# EAGLE design Accelerometer Schematic Rev1 (EAGLE 9.6.2)
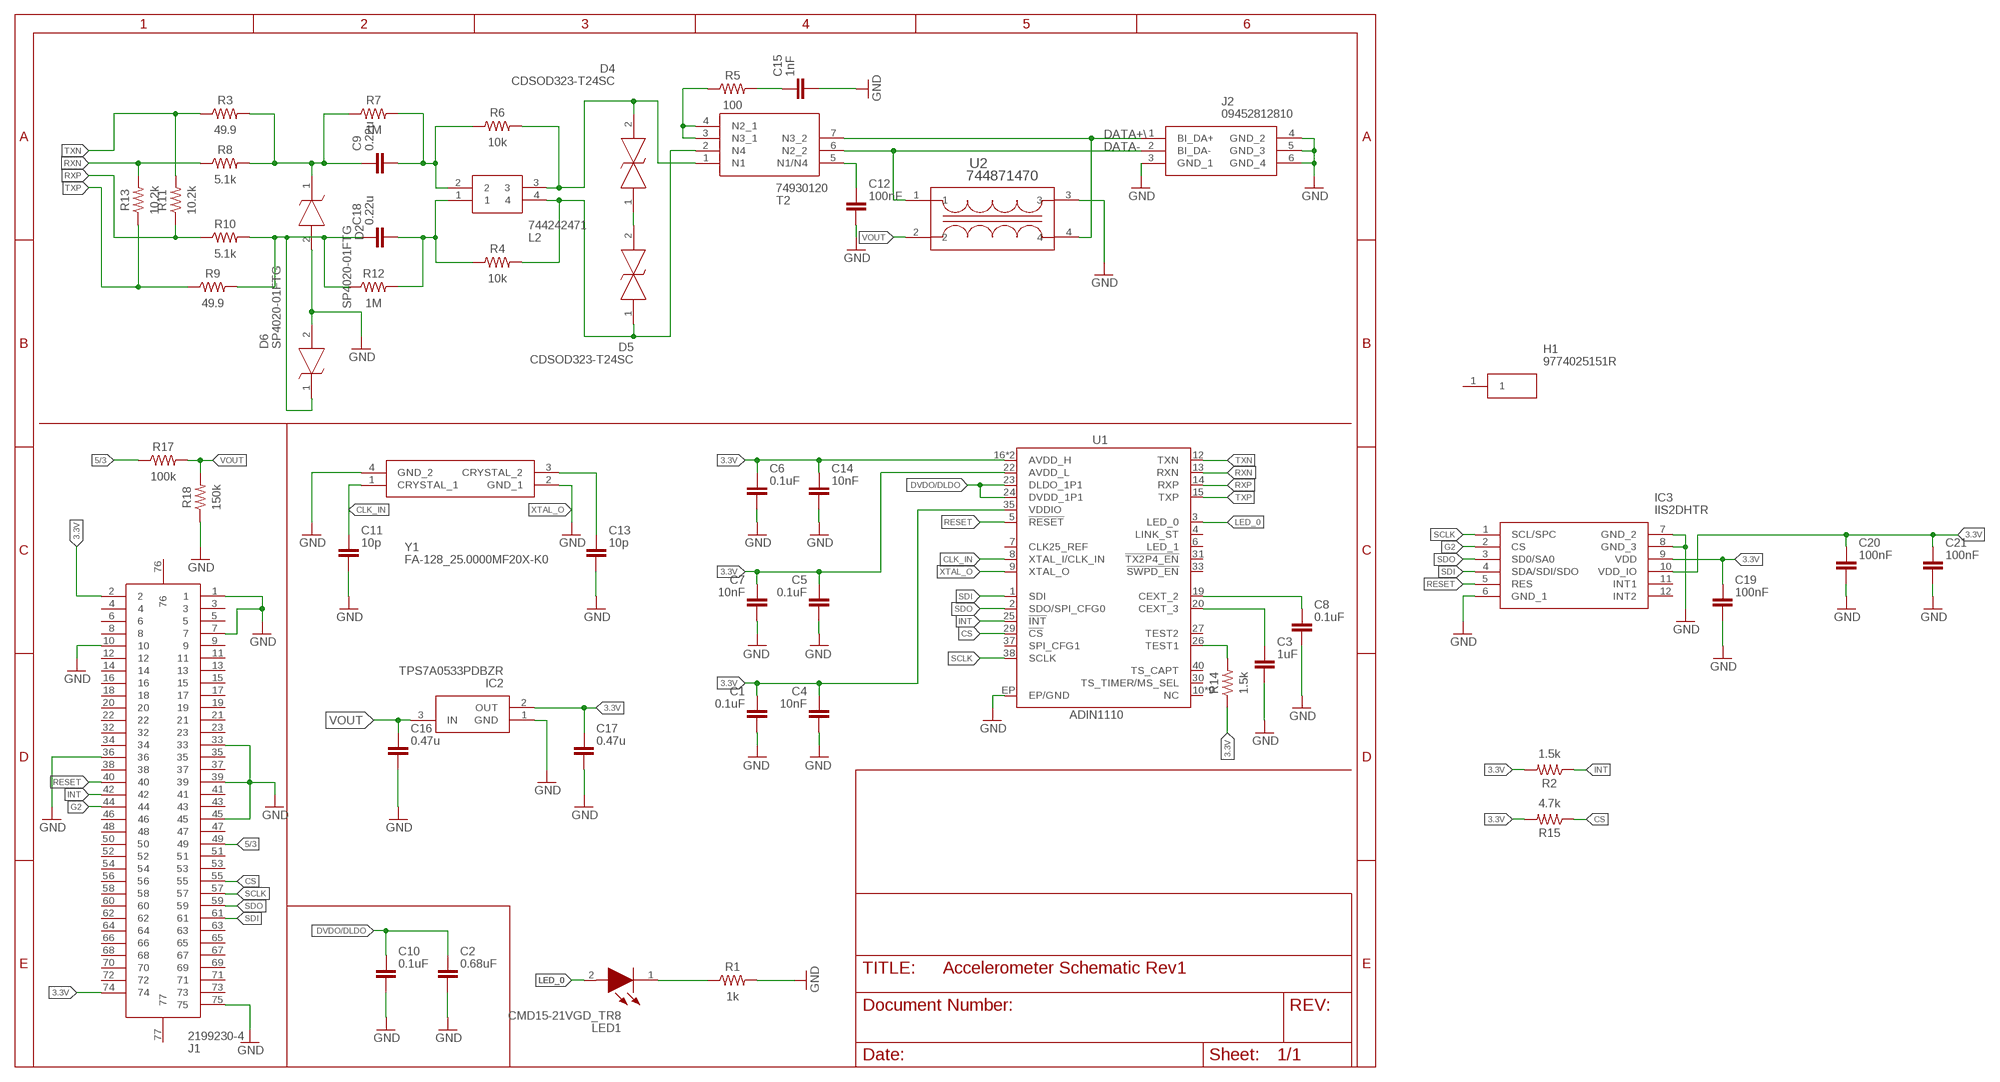
[diagram p0: schematic, sheet 1]

## Parts
C1  0.1uF  C_CHIP-0402(1005-METRIC)  [CAPC1005X60]
C2  0.68uF  C_CHIP-0402(1005-METRIC)  [CAPC1005X60]
C3  1uF  C_CHIP-0402(1005-METRIC)  [CAPC1005X60]
C4  10nF  C_CHIP-0402(1005-METRIC)  [CAPC1005X60]
C5  0.1uF  C_CHIP-0402(1005-METRIC)  [CAPC1005X60]
C6  0.1uF  C_CHIP-0402(1005-METRIC)  [CAPC1005X60]
C7  10nF  C_CHIP-0402(1005-METRIC)  [CAPC1005X60]
C8  0.1uF  C_CHIP-0402(1005-METRIC)  [CAPC1005X60]
C9  0.22u  C_CHIP-0402(1005-METRIC)  [CAPC1005X60]
C10  0.1uF  C_CHIP-0402(1005-METRIC)  [CAPC1005X60]
C11  10p  C_CHIP-0402(1005-METRIC)  [CAPC1005X60]
C12  100nF  C_CHIP-0402(1005-METRIC)  [CAPC1005X60]
C13  10p  C_CHIP-0402(1005-METRIC)  [CAPC1005X60]
C14  10nF  C_CHIP-0402(1005-METRIC)  [CAPC1005X60]
C15  1nF  C_CHIP-0402(1005-METRIC)  [CAPC1005X60]
C16  0.47u  C_CHIP-0402(1005-METRIC)  [CAPC1005X60]
C17  0.47u  C_CHIP-0402(1005-METRIC)  [CAPC1005X60]
C18  0.22u  C_CHIP-0402(1005-METRIC)  [CAPC1005X60]
C19  100nF  C_CHIP-0402(1005-METRIC)  [CAPC1005X60]
C20  100nF  C_CHIP-0402(1005-METRIC)  [CAPC1005X60]
C21  100nF  C_CHIP-0402(1005-METRIC)  [CAPC1005X60]
D2  SP4020-01FTG  [SOD2613X114N]
D4  CDSOD323-T24SC  [SOD2513X114N]
D5  CDSOD323-T24SC  [SOD2513X114N]
D6  SP4020-01FTG  [SOD2613X114N]
H1  9774025151R  [9774025151R]
IC2  TPS7A0533PDBZR  [SOT95P237X112-3N]
IC3  IIS2DHTR  [LGA-12]
J1  2199230-4  [21992304]
J2  09452812810  [09452812810]
L2  744242471  [744242471]
LED1  CMD15-21VGD_TR8  [LEDC3215X130N]
R1  1k  R-US_CHIP-0402(1005-METRIC)  [RESC1005X40]
R2  1.5k  R-US_CHIP-0402(1005-METRIC)  [RESC1005X40]
R3  49.9  R-US_CHIP-0402(1005-METRIC)  [RESC1005X40]
R4  10k  R-US_CHIP-0402(1005-METRIC)  [RESC1005X40]
R5  100  R-US_CHIP-0402(1005-METRIC)  [RESC1005X40]
R6  10k  R-US_CHIP-0402(1005-METRIC)  [RESC1005X40]
R7  1M  R-US_CHIP-0402(1005-METRIC)  [RESC1005X40]
R8  5.1k  R-US_CHIP-0402(1005-METRIC)  [RESC1005X40]
R9  49.9  R-US_CHIP-0402(1005-METRIC)  [RESC1005X40]
R10  5.1k  R-US_CHIP-0402(1005-METRIC)  [RESC1005X40]
R11  10.2k  R-US_CHIP-0402(1005-METRIC)  [RESC1005X40]
R12  1M  R-US_CHIP-0402(1005-METRIC)  [RESC1005X40]
R13  10.2k  R-US_CHIP-0402(1005-METRIC)  [RESC1005X40]
R14  1.5k  R-US_CHIP-0402(1005-METRIC)  [RESC1005X40]
R15  4.7k  R-US_CHIP-0402(1005-METRIC)  [RESC1005X40]
R17  100k  R-US_CHIP-0402(1005-METRIC)  [RESC1005X40]
R18  150k  R-US_CHIP-0402(1005-METRIC)  [RESC1005X40]
T2  74930120  [74930120]
U1  ADIN1110  [LFCSP-40]
U2  744871470  [SMT_871470_WRE]
Y1  FA-128_25.0000MF20X-K0  [FA128250000MF20XK0]

## Nets
3.3V: C1.1 C4.1 C5.1 C6.1 C7.1 C14.1 C17.1 C19.1 C20.1 C21.1 IC2.2(OUT) IC3.9(VDD) IC3.10(VDD_IO) J1.2 J1.74 R2.2 R14.1 R15.2 U1.16(AVDD_H) U1.17(AVDD_H) U1.22(AVDD_L) U1.35(VDDIO)
5/3: J1.49 R17.1
CLK_IN: C11.1 U1.8(XTAL_I/CLK_IN) Y1.1(CRYSTAL_1)
CS: J1.55 R15.1 U1.29(!CS!)
DATA+\: J2.1(BI_DA+) T2.7(N3_2) U2.4
DATA-: J2.2(BI_DA-) T2.6(N2_2) U2.1
DVDO/DLDO: C2.1 C10.1 U1.23(DLDO_1P1) U1.24(DVDD_1P1)
G2: IC3.2(CS) J1.44
GND: C1.2 C2.2 C3.2 C4.2 C5.2 C6.2 C7.2 C8.2 C10.2 C11.2 C12.2 C13.2 C14.2 C15.2 C16.2 C17.2 C19.2 C20.2 C21.2 D2.2(A) D6.2(A) IC2.1(GND) IC3.6(GND_1) IC3.7(GND_2) IC3.8(GND_3) J1.1 J1.7 J1.10 J1.33 J1.36 J1.39 J1.45 J1.75 J2.3(GND_1) J2.4(GND_2) J2.5(GND_3) J2.6(GND_4) R1.2 R18.1 U1.EP(EP/GND) U2.3 Y1.2(GND_1) Y1.4(GND_2)
INT: J1.42 R2.1 U1.25(!INT!)
LED_0: LED1.2(A) U1.3(LED_0)
N$1: C15.1 R5.2
N$2: LED1.1(K) R1.1
N$16: C18.2 L2.1 R4.1 R12.2
N$18: R14.2 U1.26(TEST1)
N$19: C9.2 L2.2 R6.1 R7.2
N$20: D5.1 L2.4 R4.2 T2.2(N4)
N$21: C8.1 U1.19(CEXT_2)
N$22: C3.1 U1.20(CEXT_3)
N$24: C9.1 D2.1(K) R3.2 R7.1 R8.2
N$28: C12.1 T2.5(N1/N4)
N$30: R5.1 T2.3(N3_1) T2.4(N2_1)
N$31: C18.1 D6.1(K) R9.2 R10.2 R12.1
N$42: D4.2 L2.3 R6.2 T2.1(N1)
N$43: D4.1 D5.2
RESET: IC3.5(RES) J1.40 U1.5(!RESET!)
RXN: R8.1 R13.2 U1.13(RXN)
RXP: R10.1 R11.1 U1.14(RXP)
SCLK: IC3.1(SCL/SPC) J1.57 U1.38(SCLK)
SDI: IC3.4(SDA/SDI/SDO) J1.61 U1.1(SDI)
SDO: IC3.3(SD0/SA0) J1.59 U1.2(SDO/SPI_CFG0)
TXN: R3.1 R11.2 U1.12(TXN)
TXP: R9.1 R13.1 U1.15(TXP)
VOUT: C16.1 IC2.3(IN) R17.2 R18.2 U2.2
XTAL_O: C13.1 U1.9(XTAL_O) Y1.3(CRYSTAL_2)
Unconnected: H1.1 IC3.11(INT1) IC3.12(INT2) J1.3 J1.4 J1.5 J1.6 J1.8 J1.9 J1.11 J1.12 J1.13 J1.14 J1.15 J1.16 J1.17 J1.18 J1.19 J1.20 J1.21 J1.22 J1.23 J1.32 J1.34 J1.35 J1.37 J1.38 J1.41 J1.43 J1.46 J1.47 J1.48 J1.50 J1.51 J1.52 J1.53 J1.54 J1.56 J1.58 J1.60 J1.62 J1.63 J1.64 J1.65 J1.66 J1.67 J1.68 J1.69 J1.70 J1.71 J1.72 J1.73 J1.76 J1.77 U1.4(LINK_ST) U1.6(LED_1) U1.7(CLK25_REF) U1.10(NC) U1.11(NC) U1.18(NC) U1.21(NC) U1.27(TEST2) U1.28(NC) U1.30(TS_TIMER/MS_SEL) U1.31(!TX2P4_EN!) U1.32(NC) U1.33(!SWPD_EN!) U1.34(NC) U1.36(NC) U1.37(SPI_CFG1) U1.39(NC) U1.40(TS_CAPT)

## Library data of the parts
C1-C21 = Capacitor:C: Capacitor - Generic; CATEGORY: Capacitor
D2 D6 = SamacSys_Parts:SP4020-01FTG: Littelfuse TVS Diode Array Uni-Directional, 750W Triple, 2-Pin SOD-323 SP4020-01FTG, Source: Datasheet <https://www.littelfuse.com/~/media/electronics/datasheets/tvs_diode_arrays/littelfuse_tvs_diode_array_sp4020_datasheet.pdf.pdf>; DESCRIPTION: Littelfuse TVS Diode Array Uni-Directional, 750W Triple, 2-Pin SOD-323 SP4020-01FTG,; HEIGHT: 1.14mm; MANUFACTURER_NAME: LITTELFUSE; MANUFACTURER_PART_NUMBER: SP4020-01FTG; MOUSER_PART_NUMBER: 576-SP4020-01FTG; MOUSER_PRICE-STOCK: https://www.mouser.co.uk/ProductDetail/Littelfuse/SP4020-01FTG?qs=eIdvKxokjW4Yi6Ov7kZjPg%3D%3D
D4 D5 = SamacSys_Parts:CDSOD323-T24SC: ESD Suppressors / TVS Diodes Bidirectional Std Cap Source: Datasheet <https://www.bourns.com/docs/Product-Datasheets/CDSOD323-TxxLC.pdf>; ARROW_PART_NUMBER: CDSOD323-T24SC; ARROW_PRICE-STOCK: https://www.arrow.com/en/products/cdsod323-t24sc/bourns?region=nac; DESCRIPTION: ESD Suppressors / TVS Diodes Bidirectional Std Cap; HEIGHT: 1.14mm; MANUFACTURER_NAME: Bourns; MANUFACTURER_PART_NUMBER: CDSOD323-T24SC; MOUSER_PART_NUMBER: 652-CDSOD323-T24SC; MOUSER_PRICE-STOCK: https://www.mouser.co.uk/ProductDetail/Bourns/CDSOD323-T24SC?qs=6S5Watp5UnLXKCNVDRqkmw%3D%3D
H1 = 9774025151R:9774025151R: 9774025151R, 2.5mm High Steel Round Spacer With 5.1mm Diameter and 3.5mm Bore Diameter for M2.5 Screw Source: Datasheet <https://componentsearchengine.com/Datasheets/2/9774025151R.pdf>; DESCRIPTION: 9774025151R, 2.5mm High Steel Round Spacer With 5.1mm Diameter and 3.5mm Bore Diameter for M2.5 Screw; HEIGHT: 3.9mm; MANUFACTURER_NAME: Wurth Elektronik; MANUFACTURER_PART_NUMBER: 9774025151R; MOUSER_PART_NUMBER: 710-9774025151R; MOUSER_PRICE-STOCK: https://www.mouser.co.uk/ProductDetail/Wurth-Elektronik/9774025151R?qs=KRpiEsko4Hn1l7MecUfDpA%3D%3D
IC2 = SamacSys_Parts:TPS7A0533PDBZR: 1-A, ultra-low-IQ, 200-mA low-dropout (LDO) regulator in a small-sized package Source: Datasheet <https://www.ti.com/lit/gpn/TPS7A05>; DESCRIPTION: 1-A, ultra-low-IQ, 200-mA low-dropout (LDO) regulator in a small-sized package; HEIGHT: 1.12mm; MANUFACTURER_NAME: Texas Instruments; MANUFACTURER_PART_NUMBER: TPS7A0533PDBZR; MOUSER_PART_NUMBER: 595-TPS7A0533PDBZR; MOUSER_PRICE-STOCK: https://www.mouser.co.uk/ProductDetail/Texas-Instruments/TPS7A0533PDBZR?qs=XeJtXLiO41SvDtfTV1kb9A%3D%3D
IC3 = SamacSys_Parts:IIS2DHTR: STMicroelectronics IIS2DHTR 3-Axis Accelerometer Ic, 1.71 3.6 V 12-Pin LGA Source: Datasheet <http://www.st.com/content/ccc/resource/technical/document/datasheet/group1/35/6d/04/26/27/5c/4d/7c/DM00171283/files/DM00171283.pdf/jcr:content/translations/en.DM00171283.pdf>; ARROW_PART_NUMBER: IIS2DHTR; ARROW_PRICE-STOCK: https://www.arrow.com/en/products/iis2dhtr/stmicroelectronics; DESCRIPTION: STMicroelectronics IIS2DHTR 3-Axis Accelerometer Ic, 1.71 3.6 V 12-Pin LGA; HEIGHT: mm; MANUFACTURER_NAME: STMicroelectronics; MANUFACTURER_PART_NUMBER: IIS2DHTR; MOUSER_PART_NUMBER: 511-IIS2DHTR; MOUSER_PRICE-STOCK: https://www.mouser.co.uk/ProductDetail/STMicroelectronics/IIS2DHTR?qs=v3MacVxtdDJnR1enHkQ8Pw%3D%3D
J1 = SamacSys_Parts:2199230-4: AMP - TE CONNECTIVITY - 2199230-4 - CONNECTOR, CARD EDGE, RCPT, 67POS, 2ROW Source: Datasheet <https://www.te.com/commerce/DocumentDelivery/DDEController?Action=srchrtrv&DocNm=2199230&DocType=Customer Drawing&DocLang=English&DocFormat=pdf&PartCntxt=2199230-4>; DESCRIPTION: AMP - TE CONNECTIVITY - 2199230-4 - CONNECTOR, CARD EDGE, RCPT, 67POS, 2ROW; HEIGHT: mm; MANUFACTURER_NAME: TE Connectivity; MANUFACTURER_PART_NUMBER: 2199230-4; MOUSER_PART_NUMBER: 571-2199230-4; MOUSER_PRICE-STOCK: https://www.mouser.co.uk/ProductDetail/TE-Connectivity/2199230-4?qs=EQCnRgr4b6HnhitEoflgGQ%3D%3D
J2 = SamacSys_Parts:09452812810: T1 Industrial Jack Connectors, PCB connector, Angled, THR connection, Rated current: 4 A, Contacts: 2, + shielding Source: Datasheet <https://b2b.harting.com/files/download/PRD/PDF_TS/09452812810_100689697DRW003M.pdf?siteName=Ebusiness Site&autoLogoutEnabled=false&autoLogoutTime=0&contextURL=https://b2b.harting.com/ebusiness/en&maintenanceAnnouncement={ }&showPrivacyEmailA>; DESCRIPTION: T1 Industrial Jack Connectors, PCB connector, Angled, THR connection, Rated current: 4 A, Contacts: 2, + shielding; HEIGHT: 6.1mm; MANUFACTURER_NAME: HARTING; MANUFACTURER_PART_NUMBER: 09452812810; MOUSER_PART_NUMBER: 617-09452812810; MOUSER_PRICE-STOCK: https://www.mouser.co.uk/ProductDetail/HARTING/09452812810?qs=IPgv5n7u5QYWjjwXDCl9%252Bw%3D%3D
L2 = SamacSys_Parts:744242471: WE-SLM SMD Common Mode Choke 470uH 400mA Source: Datasheet <http://katalog.we-online.com/pbs/datasheet/744242471.pdf>; DESCRIPTION: WE-SLM SMD Common Mode Choke 470uH 400mA; HEIGHT: 3mm; MANUFACTURER_NAME: Wurth Elektronik; MANUFACTURER_PART_NUMBER: 744242471; MOUSER_PART_NUMBER: 710-744242471; MOUSER_PRICE-STOCK: https://www.mouser.co.uk/ProductDetail/Wurth-Elektronik/744242471?qs=PGXP4M47uW7UIiGXUC0ZiA%3D%3D
LED1 = SamacSys_Parts:CMD15-21VGD_TR8: VCC CMD15-21VGD/TR8, CMD15-21 Series Clear LED, 570 nm,, Rectangle Lens Source: Datasheet <https://componentsearchengine.com/Datasheets/2/CMD15-21VGD_TR8.pdf>; ARROW_PART_NUMBER: CMD15-21VGD/TR8; ARROW_PRICE-STOCK: https://www.arrow.com/en/products/cmd15-21vgdtr8/visual-communications; DESCRIPTION: VCC CMD15-21VGD/TR8, CMD15-21 Series Clear LED, 570 nm,, Rectangle Lens; HEIGHT: 1.3mm; MANUFACTURER_NAME: Visual Communications Company; MANUFACTURER_PART_NUMBER: CMD15-21VGD/TR8; MOUSER_PART_NUMBER: 606-CMD15-21VGD/TR8; MOUSER_PRICE-STOCK: https://www.mouser.co.uk/ProductDetail/VCC/CMD15-21VGD-TR8?qs=rmKzSijf6EYPDoIZjcp6ew%3D%3D
R1-R15 R17 R18 = Resistor:R-US: Resistor Fixed - ANSI; CATEGORY: Resistor; SUB-CATEGORY: Fixed
T2 = SamacSys_Parts:74930120: WURTH ELEKTRONIK - 74930120 - Transformer, Ethernet, 1P, 10/100/1000/10G Base-T, PoE+, 1:1, Surface Mount Source: Datasheet <https://www.we-online.com/catalog/datasheet/74930120.pdf>; DESCRIPTION: WURTH ELEKTRONIK - 74930120 - Transformer, Ethernet, 1P, 10/100/1000/10G Base-T, PoE+, 1:1, Surface Mount; HEIGHT: 2.9mm; MANUFACTURER_NAME: Wurth Elektronik; MANUFACTURER_PART_NUMBER: 74930120; MOUSER_PART_NUMBER: 710-74930120; MOUSER_PRICE-STOCK: https://www.mouser.co.uk/ProductDetail/Wurth-Elektronik/74930120?qs=zW32dvEIR3sEJWqR2tCkqQ%3D%3D
U1 = ADIN1110:ADIN1110: The ADIN1110 is an ultra low power, single port, 10BASE-T1L transceiver design for industrial Ethernet applications and is compliant with the IEEE® 802.3cg-2019™ Ethernet standard for long reach, 10 Mbps single pair Ethernet (SPE).; PROD_ID: IC-16335
U2 = 744871470:744871470; COPYRIGHT: Copyright (C) 2023 Ultra Librarian. All rights reserved.; MANUFACTURER_PART_NUMBER: 744871470; MFR_NAME: Wurth Electronics
Y1 = SamacSys_Parts:FA-128_25.0000MF20X-K0: Crystals 25MHz 10PPM -40C +85C 10pF Source: Datasheet <https://support.epson.biz/td/api/doc_check.php?dl=brief_FA-128&lang=en>; DESCRIPTION: Crystals 25MHz 10PPM -40C +85C 10pF; HEIGHT: 0.5mm; MANUFACTURER_NAME: Epson Timing; MANUFACTURER_PART_NUMBER: FA-128 25.0000MF20X-K0; MOUSER_PART_NUMBER: 732-FA-12825F20X-K0; MOUSER_PRICE-STOCK: https://www.mouser.co.uk/ProductDetail/Epson-Timing/FA-128-250000MF20X-K0?qs=csoGsJbXmtBBrE23v3bRHg%3D%3D

## Board
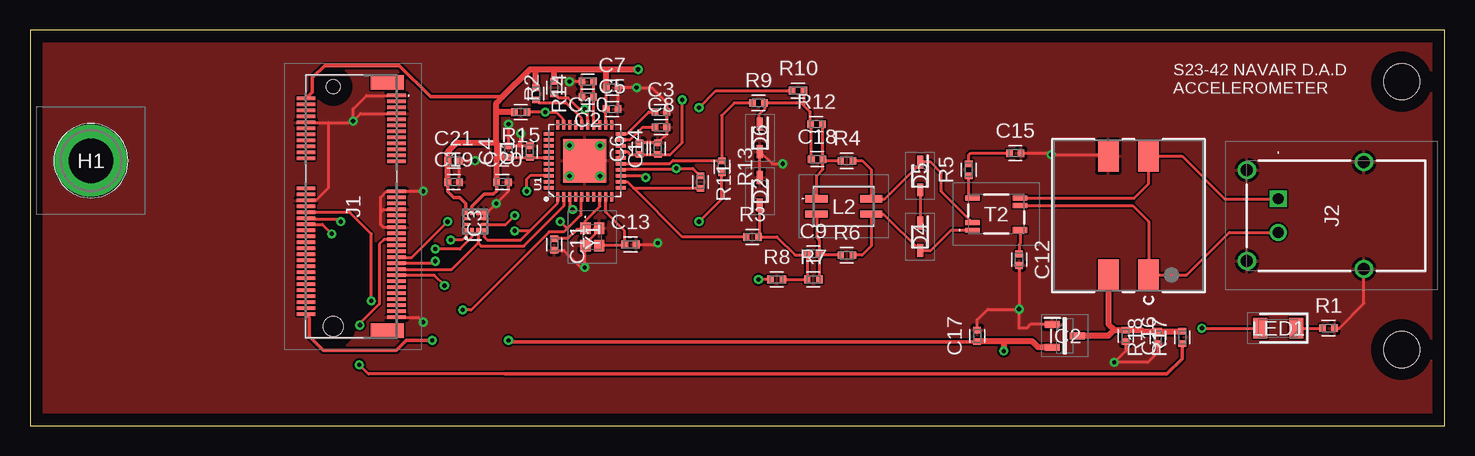
[diagram p1: board, top side]
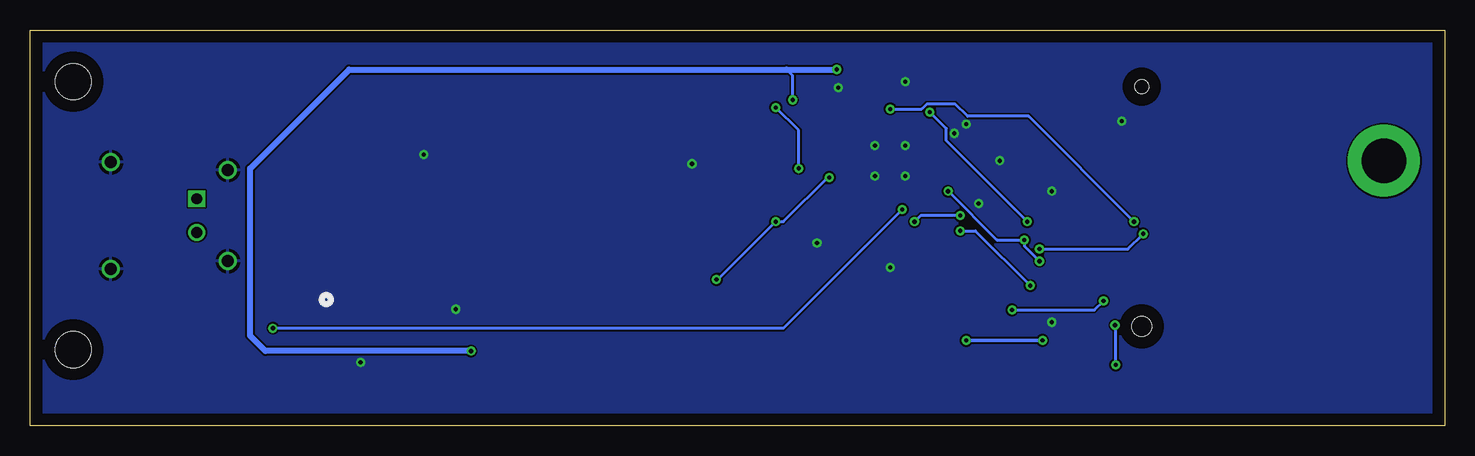
[diagram p2: board, bottom side, seen from below]

Size 117.91 x 33.01 mm. Coordinates in mm from the lower left corner, seen from the top.
Outline: 0,0 117.91,0 117.91,33.01 0,33.01 0,0
Copper layers (1*16): Top 0.035mm / dielectric 1.5mm / Bottom 0.035mm
Design rules "default": minimum track width 6mil, minimum drill 0.35mm, track to track 6mil, track to pad 6mil, pad to pad 6mil, via to via 6mil, smd to smd 6mil, copper to edge 40mil, drill to drill 6mil, minimum pad ring 10mil, minimum via ring 8mil, stop-mask expansion 4mil, vias tented up to drill 0mil, thermal gap 10mil
Holes 3 mm at 114.3,28.7 114.3,6.35

### Footprints (pad centres in the part's own frame; a part is rotated, then mirrored left to right if it is on the bottom)
CAPC1005X60 = smd 0.56 x 0.629: 1 -0.485,0; 2 0.485,0
SOD2613X114N = smd 1.075 x 0.5: 1 -1.15,0; 2 1.15,0
SOD2513X114N = smd 1.075 x 0.5: 1 -1.15,0; 2 1.15,0
9774025151R = drill 3.7 pad 6: 1 0,0
SOT95P237X112-3N = smd 1.25 x 0.6: 1 -1.05,0.95; 2 -1.05,-0.95; 3 1.05,0
LGA-12 = smd 0.508 x 0.254: 1 -0.8,0.75; 2 -0.8,0.25; 3 -0.8,-0.25; 4 -0.8,-0.75; 7 0.8,-0.75; 8 0.8,-0.25; 9 0.8,0.25; 10 0.8,0.75 | smd 0.254 x 0.508: 5 -0.25,-0.75; 6 0.25,-0.75; 11 0.25,0.75; 12 -0.25,0.75
21992304 = smd 0.3 x 1.55: 1 -9.25,3.625; 2 -9,-3.925; 3 -8.75,3.625; 4 -8.5,-3.925; 5 -8.25,3.625; 6 -8,-3.925; 7 -7.75,3.625; 8 -7.5,-3.925; 9 -7.25,3.625; 10 -7,-3.925; 11 -6.75,3.625; 12 -6.5,-3.925; 13 -6.25,3.625; 14 -6,-3.925; 15 -5.75,3.625; 16 -5.5,-3.925; 17 -5.25,3.625; 18 -5,-3.925; 19 -4.75,3.625; 20 -4.5,-3.925; 21 -4.25,3.625; 22 -4,-3.925; 23 -3.75,3.625; 32 -1.5,-3.925; 33 -1.25,3.625; 34 -1,-3.925; 35 -0.75,3.625; 36 -0.5,-3.925; 37 -0.25,3.625; 38 0,-3.925; 39 0.25,3.625; 40 0.5,-3.925; 41 0.75,3.625; 42 1,-3.925; 43 1.25,3.625; 44 1.5,-3.925; 45 1.75,3.625; 46 2,-3.925; 47 2.25,3.625; 48 2.5,-3.925; 49 2.75,3.625; 50 3,-3.925; 51 3.25,3.625; 52 3.5,-3.925; 53 3.75,3.625; 54 4,-3.925; 55 4.25,3.625; 56 4.5,-3.925; 57 4.75,3.625; 58 5,-3.925; 59 5.25,3.625; 60 5.5,-3.925; 61 5.75,3.625; 62 6,-3.925; 63 6.25,3.625; 64 6.5,-3.925; 65 6.75,3.625; 66 7,-3.925; 67 7.25,3.625; 68 7.5,-3.925; 69 7.75,3.625; 70 8,-3.925; 71 8.25,3.625; 72 8.5,-3.925; 73 8.75,3.625; 74 9,-3.925; 75 9.25,3.625 | smd 1.2 x 2.75: 76 -10.35,2.85; 77 10.35,2.85 | hole 1.15: -10,-1.65 | hole 1.65: 10,-1.65
09452812810 = drill 0.9 pad 1.4 square: 1 0,0 | drill 0.9 pad 1.4: 2 -2.8,0 | drill 1 pad 1.5: 3 -5.2,2.6; 4 2.4,2.6; 5 -5.85,-7.15; 6 3.05,-7.15
744242471 = smd 1.85 x 0.6: 1 -2.275,0.635; 2 -2.275,-0.635; 3 2.275,-0.635; 4 2.275,0.635
LEDC3215X130N = smd 1.15 x 1.7: 1 -1.5,0; 2 1.5,0
RESC1005X40 = smd 0.535 x 0.644: 1 -0.507,0; 2 0.507,0
74930120 = smd 1.2 x 0.41: 1 -1.99,-1.35; 2 -1.99,-0.7; 6 1.99,0.7; 7 1.99,1.35 | smd 0.6 x 0.41: 3 -2.29,1.35; 4 -1.69,1.35 | smd 1.2 x 0.5: 5 1.99,-1.35
LFCSP-40 = smd 0.8 x 0.285: 1 -3,2.25; 2 -3,1.75; 3 -3,1.25; 4 -3,0.75; 5 -3,0.25; 6 -3,-0.25; 7 -3,-0.75; 8 -3,-1.25; 9 -3,-1.75; 10 -3,-2.25; 21 3,-2.25; 22 3,-1.75; 23 3,-1.25; 24 3,-0.75; 25 3,-0.25; 26 3,0.25; 27 3,0.75; 28 3,1.25; 29 3,1.75; 30 3,2.25 | smd 0.285 x 0.8: 11 -2.25,-3; 12 -1.75,-3; 13 -1.25,-3; 14 -0.75,-3; 15 -0.25,-3; 16 0.25,-3; 17 0.75,-3; 18 1.25,-3; 19 1.75,-3; 20 2.25,-3; 31 2.25,3; 32 1.75,3; 33 1.25,3; 34 0.75,3; 35 0.25,3; 36 -0.25,3; 37 -0.75,3; 38 -1.25,3; 39 -1.75,3; 40 -2.25,3 | smd 3.6 x 3.6: EP 0,0
SMT_871470_WRE = smd 2.591 x 1.702: 1 0,0; 2 0,3.35; 3 9.9,3.35; 4 9.9,0
FA128250000MF20XK0 = smd 0.95 x 0.85: 1 -0.725,-0.575; 2 0.725,-0.575; 3 0.725,0.575; 4 -0.725,0.575

### Placement (x,y rotation side)
C1  41.66,22.86 90 top
C2  46.48,27.43 180 top
C3  52.58,26.16 0 top
C4  39.88,22.86 90 top
C5  48.51,26.42 0 top
C6  50.8,23.11 90 top
C7  48.51,28.19 0 top
C8  52.58,24.89 0 top
C9  65.28,14.35 0 top
C10  46.48,28.7 180 top
C11  43.69,15.11 270 top
C12  82.42,13.84 270 top
C13  50.04,15.11 0 top
C14  52.32,23.11 90 top
C15  82.11,22.73 0 top
C16  91.31,7.49 270 top
C17  78.93,7.49 90 top
C18  65.6,22.23 0 top
C19  35.31,20.32 0 top
C20  39.37,20.32 0 top
C21  35.31,22.1 0 top
D2  60.83,19.56 90 top
D4  74.17,15.75 270 top
D5  74.17,20.83 270 top
D6  60.83,24 270 top
H1  5.08,22.1 0 top
IC2  86.23,7.49 0 top
IC3  37.08,17.02 90 top
J1  26.92,18.29 270 top
J2  104.01,18.92 90 top
L2  67.82,18.29 0 top
LED1  104.01,8.13 180 top
R1  108.2,8.13 0 top
R2  43.69,28.19 90 top
R3  60.2,15.75 0 top
R4  68.07,22.1 0 top
R5  78.23,21.34 90 top
R6  68.07,14.22 0 top
R7  65.28,12.19 0 top
R8  62.23,12.19 0 top
R9  60.71,26.92 0 top
R10  64.01,27.94 0 top
R11  55.88,20.32 270 top
R12  65.53,25.15 0 top
R13  57.66,21.59 270 top
R14  42.16,27.69 270 top
R15  40.89,26.16 180 top
R17  96.01,7.37 90 top
R18  93.98,7.37 90 top
T2  80.52,17.65 0 top
U1  46.23,22.1 90 top
U2  93.22,12.57 90 top
Y1  46.86,15.75 270 top

### Tracks (layer width: path | path; a pad name or v marks a point on that pad's centre or on a via)
3.3V  (via drill 0.35)
  Top 0.254: U1.16 U1.17 49.8,22.85 50.04,22.61 50.78,22.61 C6.1 C14.1 53.36,22.63 54.36,23.62 v54.36,27.18 | U1.22 47.98,26.36 C5.1 C7.1 | C4.1 C1.1 43.2,22.38 U1.35
  Top 0.305: J1.2 23.53,27.82 23.53,29.01 24.55,30.03 30.79,30.03 33.39,27.43 39.37,27.43 | C17.1 39.98,7.01 v39.88,7.11 | v33.53,7.11 31.35,7.11 30.54,6.29 24.45,6.29 23.28,7.46 23.28,9.01 J1.74 | IC3.9 36.83,18.29 37.85,19.3 38.61,19.3 38.88,19.58 C20.1 | IC3.10 36.32,18.54 35.81,19.05 35.31,19.05 34.82,19.54 C19.1
  Top 0.508: IC2.2 84.01,6.54 83.52,7.03 81.15,7.03 | 81.15,7.03 v81.15,6.22 | 81.15,7.03 78.95,7.03 C17.1 | v50.67,29.72 48.01,29.72 | 48.01,29.72 43.69,29.72 | 43.69,29.72 42.16,29.72 | 42.16,29.72 41.66,29.72 39.37,27.43 38.86,26.92 38.86,26.16 | C4.1 38.88,22.38 | R14.1 42.16,29.72 | C7.1 48.01,28.22 48.01,29.72 | C19.1 C21.1 34.82,22.88 35.56,23.62 38.86,23.62 | 38.86,23.62 38.86,26.16 | 38.86,23.62 38.88,23.6 38.88,22.38 | C20.1 38.88,22.38 | R15.2 38.86,26.16 | R2.2 43.69,29.72
  Bottom 0.254: v54.36,27.18 54.36,29.21 54.86,29.72
  Bottom 0.305: v39.88,7.11 v33.53,7.11
  Bottom 0.508: v81.15,6.22 98.3,6.22 99.57,7.49 99.57,21.46 91.31,29.72 54.86,29.72 v50.67,29.72
5/3  (via drill 0.35)
  Top 0.254: 39.62,4.32 28.19,4.32 v27.43,5.08 | v27.49,8.38 27.49,8.53 29.11,10.14 29.11,15.14 29.51,15.54 J1.49
  Top 0.305: R17.1 96.01,5.59 94.74,4.32 39.62,4.32
  Bottom 0.254: v27.43,5.08 27.43,8.32 v27.49,8.38
CLK_IN
  Top 0.254: U1.8 47.5,19.08 47.5,18.29 46.29,17.08 Y1.1 46.2,16.38 45.59,16.38 44.81,15.6 C11.1
CS  (via drill 0.35)
  Top 0.254: U1.29 44.4,25.18 44.4,25.61 43.85,26.16 v42.93,26.16 R15.1 | J1.55 31.82,14.04 v34.8,17.02
  Bottom 0.254: v42.93,26.16 41.55,24.79 41.55,23.77 v34.8,17.02
DATA+\
  Top 0.254: J2.1 99.57,18.92 96.02,22.47 U2.4 93.22,20.19 92.03,19 T2.7
DATA-
  Top 0.254: J2.2 99.94,16.12 96.39,12.57 U2.1 93.22,17.02 91.88,18.35 T2.6
DVDO/DLDO
  Top 0.254: U1.23 U1.24 C2.1 C10.1
G2  (via drill 0.35)
  Top 0.254: J1.44 24.36,16.79 v25.15,16 | IC3.2 36.83,15.75 35.81,14.73 v33.78,14.73
  Bottom 0.254: v33.78,14.73 26.42,14.73 v25.15,16
GND  (via drill 0.35)
  Top 0.254: 46.29,14.54 Y1.2 | Y1.4 47.44,16.32 46.29,15.17 Y1.2 | Y1.2 46.23,14.96 v46.23,13.21 45.91,13.21 44.49,14.63 C11.2 | v82.42,9.72 82.42,8.13 83.06,8.13 83.37,8.44 IC2.1 | J2.5 111.16,10.2 109.09,8.13 R1.2 | U1.EP v44.96,20.83 | C12.2 v82.42,9.72 | C16.2 91.31,6.22 v90.36,5.27 93.15,5.27 93.98,6.1 R18.1 | C17.2 78.93,8.83 79.82,9.72 v82.42,9.72 | C15.2 84.96,22.73 v85.09,22.61 89.73,22.61 U2.3 | C5.2 C7.2 v50.55,28.19 51.82,28.19 53.06,26.95 C3.2 C8.2 53.06,24.34 C14.2 C6.2 | D2.2 D6.2 61.84,21.84 v62.74,21.84 | C1.2 40.64,23.34 C4.2 v39.88,25.15 | IC3.8 IC3.7 | IC3.7 IC3.6 | C13.2 52.2,15.11 v52.32,15.24 | C19.2 C21.2 v37.08,22.1 | IC3.7 38.14,17.82 v38.86,18.54 39.85,19.54 C20.2 | v32.77,19.56 30.57,19.56 J1.33 29.7,19.54 29.21,19.05 29.21,17.78 | J1.10 24.89,25.29 | 24.89,25.29 26.81,25.29 v26.92,25.4 | v26.92,25.4 26.92,26.42 28.05,27.54 J1.1 | v26.92,25.4 27.56,26.04 J1.7 | J1.75 32.36,9.04 v32.77,8.64 | J1.45 29.44,16.54 29.21,16.76 29.21,17.78 | 29.21,17.78 29.47,18.04 J1.39 | J1.36 23.07,18.86 23.89,18.86 24.89,19.86 24.89,25.29 | v44.96,28.7 C10.2 C2.2
  Top 0.305: v40.89,24.38 40.89,23.6 40.64,23.34
  other vias: 44.96,23.37 47.5,23.37 47.5,20.83
  pour Bottom: 0,0 0,33.02 121.67,33.02 121.67,0
  pour Top: 0,0 0,33.02 117.86,33.02 117.86,0
INT  (via drill 0.35)
  Top 0.254: U1.25 46.48,26.17 v46.23,26.42 45.79,26.42 44.87,27.33 44.04,27.33 R2.1 | J1.42 23.07,17.22 25.71,17.22 v25.91,17.02
  Bottom 0.254: v46.23,26.42 43.6,26.42 43.2,26.82 40.79,26.82 39.77,25.8 34.69,25.8 v25.91,17.02
LED_0  (via drill 0.35)
  Top 0.254: v97.66,8.13 LED1.2 | U1.3 44.98,18.27 v45.21,18.03
  Bottom 0.254: v45.21,18.03 55.12,8.13 v97.66,8.13
N$1
  Top 0.254: R5.2 78.23,22.61 78.36,22.73 C15.1
N$2
  Top 0.254: LED1.1 R1.1
N$16
  Top 0.254: L2.1 65.54,20.84 66.08,21.38 C18.2 | C18.2 66.21,22.1 R4.1 | C18.2 66.08,25.11 R12.2
N$18
  Top 0.254: U1.26 45.97,25.65 44.7,26.92 42.42,26.92 R14.2
N$19
  Top 0.254: R6.1 65.89,14.22 C9.2 | C9.2 65.78,14.33 R7.2 | L2.2 65.54,15.74 65.79,15.49 65.79,14.37 C9.2
N$20
  Top 0.254: R4.2 69.34,22.1 70.09,21.35 L2.4 71.25,18.92 74.17,21.84 D5.1 75.05,21.98 75.95,21.08 75.95,19.54 T2.2
N$21
  Top 0.254: U1.19 49.26,23.88 50.04,23.88 51.05,24.89 C8.1
N$22
  Top 0.254: U1.20 49.26,24.38 49.78,24.38 51.56,26.16 C3.1
N$24
  Top 0.254: R8.2 R7.1 64.77,14.33 C9.1 64.67,14.22 63.75,14.22 62.23,15.75 R3.2 60.83,15.88 D2.1
N$28
  Top 0.254: T2.5 82.51,15.2 82.42,15.11 C12.1
N$30
  Top 0.254: R5.1 T2.3 T2.4
N$31
  Top 0.254: C18.1 65.11,25.06 R12.1 65.02,26.16 64.52,26.67 | 64.52,26.67 R10.2 | 64.52,26.67 64.26,26.92 R9.2 61.21,26.42 60.77,25.98 60.77,25.21 D6.1
N$42
  Top 0.254: R6.2 69.34,14.22 70.09,14.97 L2.3 71.11,17.65 D4.2 75.05,14.6 76.75,16.3 T2.1
N$43
  Top 0.254: D5.2 D4.1
RESET  (via drill 0.35)
  Top 0.254: U1.5 45.9,19.02 45.9,17.57 44.77,16.44 | v36.07,9.65 36.75,9.65 43.26,16.16 44.49,16.16 44.77,16.44 | v28.45,10.41 28.45,16 26.66,17.79 J1.40 | IC3.5 39.63,16.77 v40.39,17.53 | v44.2,17.02 44.77,16.44
  Bottom 0.254: v36.07,9.65 29.21,9.65 v28.45,10.41 | v40.39,17.53 43.69,17.53 v44.2,17.02
RXN  (via drill 0.35)
  Top 0.254: v51.31,20.69 51.15,20.85 U1.13 | R8.1 v60.71,12.19 | v55.75,17.02 57.66,18.92 R13.2
  Bottom 0.254: v51.31,20.69 51.31,20.83 55.12,17.02 v55.75,17.02 60.58,12.19 v60.71,12.19
RXP  (via drill 0.35)
  Top 0.254: U1.14 53.73,21.35 v53.85,21.46 55.24,21.46 R11.1 | v55.75,26.54 57.15,27.94 R10.1
  Bottom 0.254: v53.85,21.46 53.85,24.64 v55.75,26.54
SCLK  (via drill 0.35)
  Top 0.254: U1.38 41.68,20.85 41.4,20.57 v41.4,19.56 | IC3.1 36.33,15.83 36,15.49 v35.05,15.49 | v33.78,13.72 33.6,13.54 J1.57
  Bottom 0.254: v33.78,13.72 35.05,14.99 v35.05,15.49 37.34,15.49 v41.4,19.56
SDI  (via drill 0.35)
  Top 0.254: IC3.4 37.83,15.76 38.1,15.49 40.89,15.49 41.66,16.26 | U1.1 43.98,18.58 41.66,16.26 | 41.66,16.26 v40.39,16.26 | v34.54,11.68 33.69,12.54 J1.61
  Bottom 0.254: v40.39,16.26 39.12,16.26 v34.54,11.68
SDO
  Top 0.254: U1.2 44.48,18.32 41.15,14.99 37.59,14.99 37.34,15.24 | IC3.3 37.34,15.24 | 37.34,15.24 35.14,13.04 J1.59
TXN
  Top 0.254: U1.12 49.76,20.35 50.29,19.81 | 50.29,19.81 R11.2 | R11.2 | R3.1 54.36,15.75 50.29,19.81
TXP
  Top 0.254: 57.63,22.12 53.58,22.12 53.3,21.85 U1.15 | 57.63,22.12 R13.1 | R9.1 58.67,26.92 57.63,25.89 57.63,22.12
VOUT
  Top 0.508: U2.2 89.87,8.47 90.36,7.98 | 90.36,7.98 C16.1 92.61,7.98 92.71,7.87 R18.2 R17.2 | 90.36,7.98 89.87,7.49 IC2.3
XTAL_O
  Top 0.254: Y1.3 49.46,15.02 C13.1 49.55,16.23 47.98,17.81 U1.9

### Text on the board
tPlace: S23-42 NAVAIR D.A.D | ACCELEROMETER